# Altium schematic sheet nRF53.SchDoc: nRF5340
size B; DrawnBy: Sindre Hovland; Organization: Advanced Wearables Nordic Semi; Revision: V1; SheetNumber: 1; SheetTotal: 4
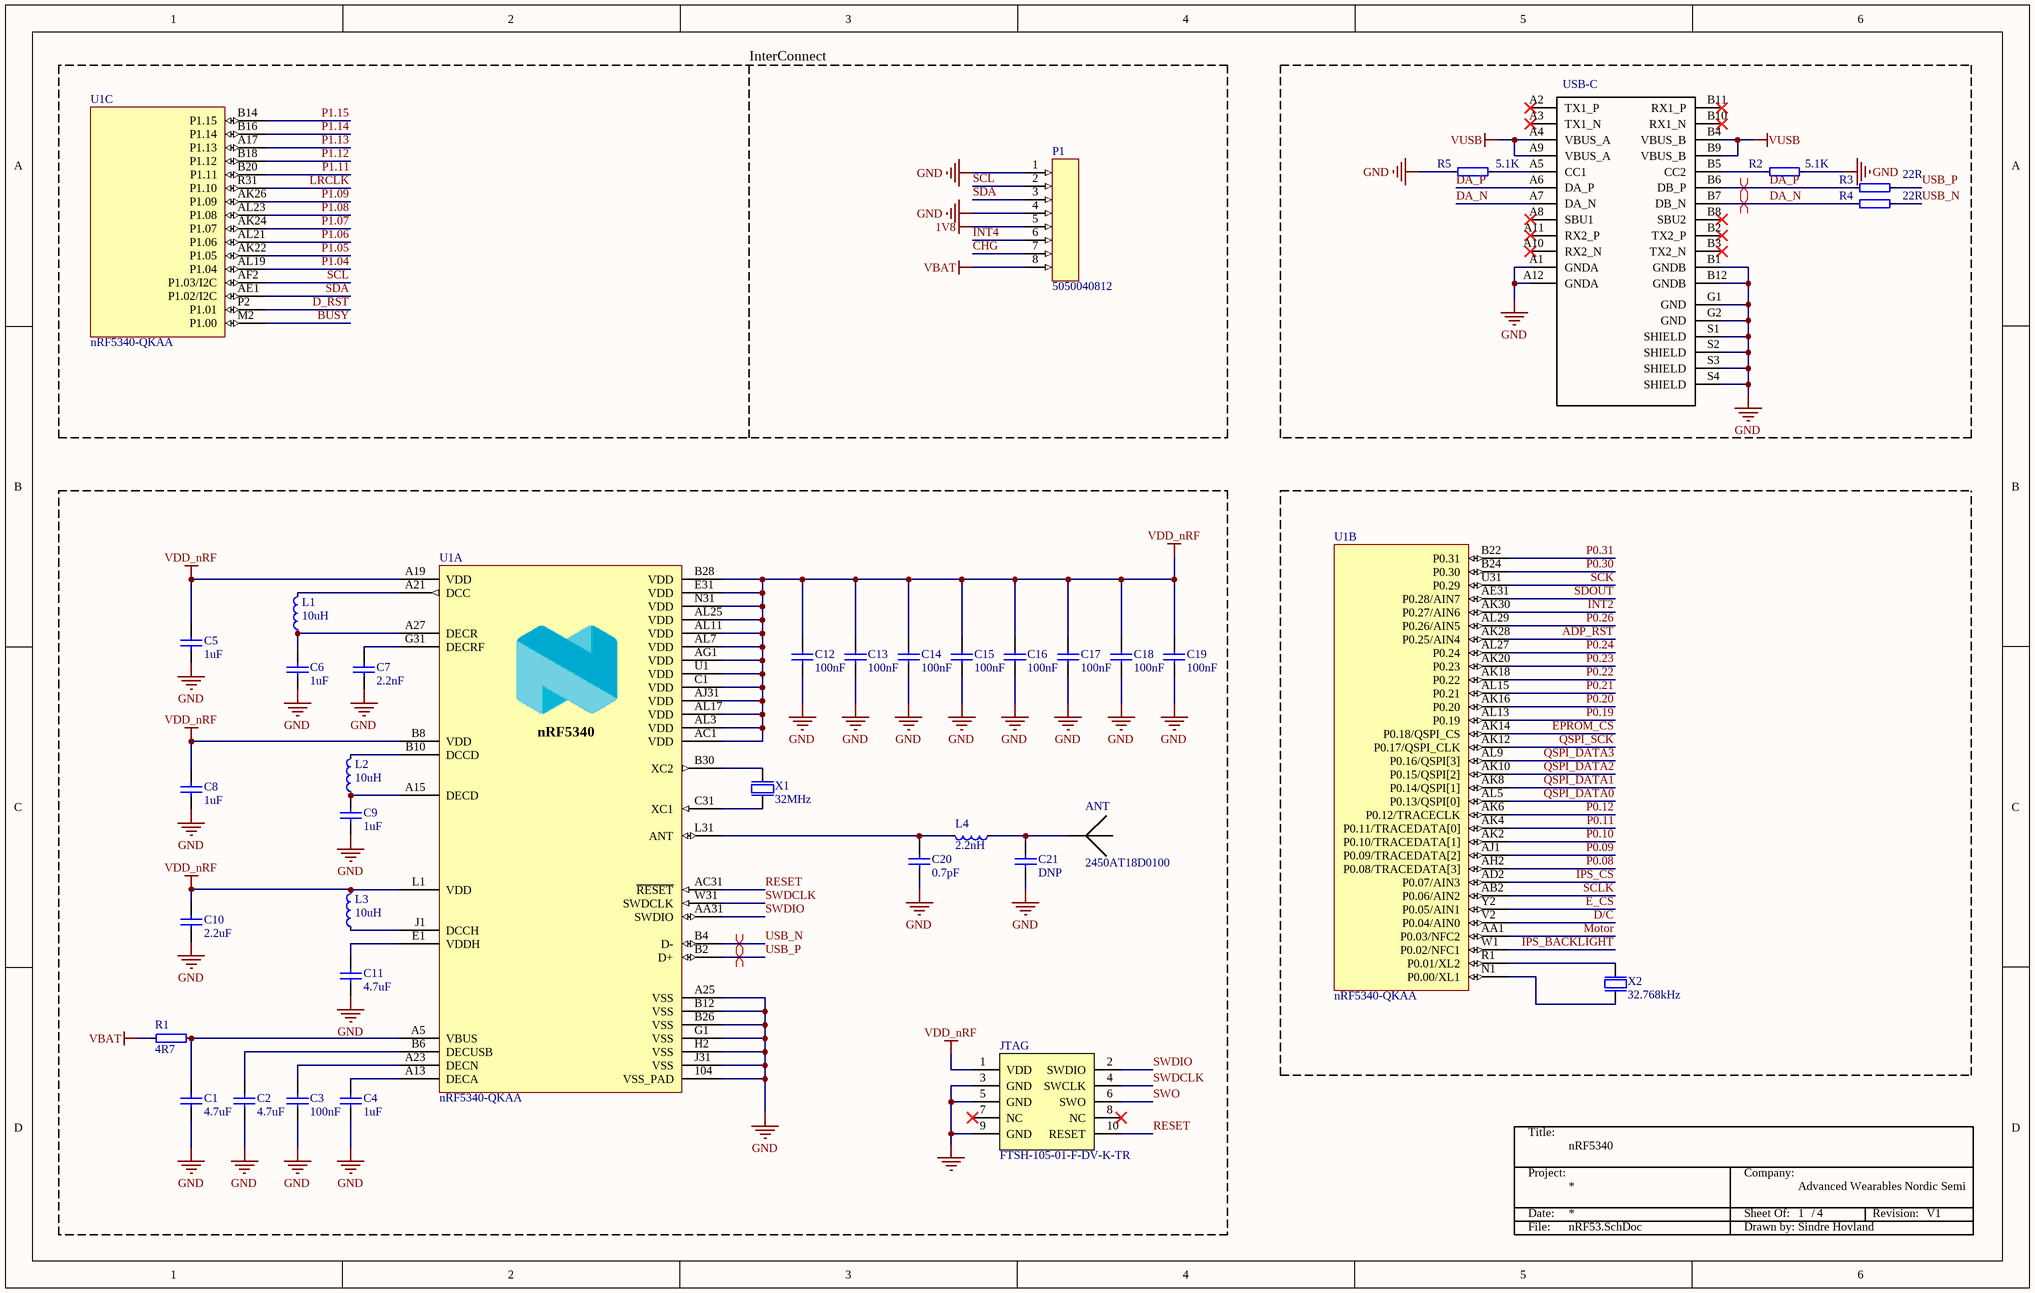
[diagram p0: nRF53.SchDoc]

## Parts
*  TitleBlock  (value not drawn)  (graphical)
ANT  2450AT18D0100  [2450AT18D0100_STD-L - Thin space]
C1  4.7uF  [C0402]
C2  4.7uF  [C0402]
C3  100nF  [C0402]
C4  1uF  [C0402]
C5  1uF  [C0402]
C6  1uF  [C0402]
C7  2.2nF  [C0402]
C8  1uF  [C0402]
C9  1uF  [C0402]
C10  2.2uF  [C0402]
C11  4.7uF  [C0402]
C12  100nF  [C0402]
C13  100nF  [C0402]
C14  100nF  [C0402]
C15  100nF  [C0402]
C16  100nF  [C0402]
C17  100nF  [C0402]
C18  100nF  [C0402]
C19  100nF  [C0402]
C20  0.7pF  [C0402]
C21  DNP  [C0402]
JTAG  FTSH-105-01-F-DV-K-TR  [TC2050-IDC-NLFP]
L1  10uH  [IND0402]
L2  10uH  [IND0402]
L3  10uH  [IND0402]
L4  2.2nH  [IND0402]
P1  5050040812  [5050040812]
R1  4R7  [RES0402]
R2  5.1K  [RES0402]
R3  22R  [RES0402]
R4  22R  [RES0402]
R5  5.1K  [RES0402]
U1  nRF5340-QKAA  [nRF5340]  (parts A,B,C of 3)
USB-C  2305018-2  [TE_2305018-2_2305018-2(Primary)]  (value not drawn)
X1  32MHz  [XTAL_2016]
X2  32.768kHz  [XTAL_2012]

## Blocks framed on the sheet
InterConnect: P1 U1

## Nets
1V8: P1.5
GND: ANT.2(GND) C1.1 C2.1 C3.1 C4.1 C5.1 C6.1 C7.1 C8.1 C9.1 C10.1 C11.1 C12.1 C13.1 C14.1 C15.1 C16.1 C17.1 C18.1 C19.1 C20.1 C21.1 JTAG.3(GND) JTAG.5(GND) JTAG.9(GND) P1.1 P1.4 R2.2 R5.1 U1.104(VSS_PAD) U1.A25(VSS) U1.B12(VSS) U1.B26(VSS) U1.G1(VSS) U1.H2(VSS) U1.J31(VSS) USB-C.A1(GNDA) USB-C.A12(GNDA) USB-C.B1(GNDB) USB-C.B12(GNDB) USB-C.G1(GND) USB-C.G2(GND) USB-C.S1(SHIELD) USB-C.S2(SHIELD) USB-C.S3(SHIELD) USB-C.S4(SHIELD) X1.2(GND) X1.4(GND)
VBAT: P1.8 R1.2
VDD_nRF: C5.2 C8.2 C10.2 C12.2 C13.2 C14.2 C15.2 C16.2 C17.2 C18.2 C19.2 JTAG.1(VDD) L3.2 U1.A19(VDD) U1.AC1(VDD) U1.AG1(VDD) U1.AJ31(VDD) U1.AL3(VDD) U1.AL7(VDD) U1.AL11(VDD) U1.AL17(VDD) U1.AL25(VDD) U1.B8(VDD) U1.B28(VDD) U1.C1(VDD) U1.E31(VDD) U1.L1(VDD) U1.N31(VDD) U1.U1(VDD)
VUSB: USB-C.A4(VBUS_A) USB-C.A9(VBUS_A) USB-C.B4(VBUS_B) USB-C.B9(VBUS_B)
ADP_RST: U1.AK28(P0.25/AIN4)
BUSY: U1.M2(P1.00)
CHG: P1.7
D/C: U1.V2(P0.04/AIN0)
D_RST: U1.P2(P1.01)
DA_N: R4.1 USB-C.A7(DA_N) USB-C.B7(DB_N)
DA_P: R3.1 USB-C.A6(DA_P) USB-C.B6(DB_P)
E_CS: U1.Y2(P0.05/AIN1)
EPROM_CS: U1.AK14(P0.18/QSPI_CS)
INT2: U1.AK30(P0.27/AIN6)
INT4: P1.6
IPS_BACKLIGHT: U1.W1(P0.02/NFC1)
IPS_CS: U1.AD2(P0.07/AIN3)
LRCLK: U1.R31(P1.10)
Motor: U1.AA1(P0.03/NFC2)
P0.08: U1.AH2(P0.08/TRACEDATA[3])
P0.09: U1.AJ1(P0.09/TRACEDATA[2])
P0.10: U1.AK2(P0.10/TRACEDATA[1])
P0.11: U1.AK4(P0.11/TRACEDATA[0])
P0.12: U1.AK6(P0.12/TRACECLK)
P0.19: U1.AL13(P0.19)
P0.20: U1.AK16(P0.20)
P0.21: U1.AL15(P0.21)
P0.22: U1.AK18(P0.22)
P0.23: U1.AK20(P0.23)
P0.24: U1.AL27(P0.24)
P0.26: U1.AL29(P0.26/AIN5)
P0.30: U1.B24(P0.30)
P0.31: U1.B22(P0.31)
P1.04: U1.AL19(P1.04)
P1.05: U1.AK22(P1.05)
P1.06: U1.AL21(P1.06)
P1.07: U1.AK24(P1.07)
P1.08: U1.AL23(P1.08)
P1.09: U1.AK26(P1.09)
P1.11: U1.B20(P1.11)
P1.12: U1.B18(P1.12)
P1.13: U1.A17(P1.13)
P1.14: U1.B16(P1.14)
P1.15: U1.B14(P1.15)
QSPI_DATA0: U1.AL5(P0.13/QSPI[0])
QSPI_DATA1: U1.AK8(P0.14/QSPI[1])
QSPI_DATA2: U1.AK10(P0.15/QSPI[2])
QSPI_DATA3: U1.AL9(P0.16/QSPI[3])
QSPI_SCK: U1.AK12(P0.17/QSPI_CLK)
RESET: JTAG.10(RESET) U1.AC31(~{RESET})
SCK: U1.U31(P0.29)
SCL: P1.2 U1.AF2(P1.03/I2C)
SCLK: U1.AB2(P0.06/AIN2)
SDA: P1.3 U1.AE1(P1.02/I2C)
SDOUT: U1.AE31(P0.28/AIN7)
SWDCLK: JTAG.4(SWCLK) U1.W31(SWDCLK)
SWDIO: JTAG.2(SWDIO) U1.AA31(SWDIO)
SWO: JTAG.6(SWO)
USB_N: R4.2 U1.B4(D-)
USB_P: R3.2 U1.B2(D+)
NetANT_1: ANT.1 C21.2 L4.1
NetC1_2: C1.2 R1.1 U1.A5(VBUS)
NetC2_2: C2.2 U1.B6(DECUSB)
NetC3_2: C3.2 U1.A23(DECN)
NetC4_2: C4.2 U1.A13(DECA)
NetC6_2: C6.2 L1.1 U1.A27(DECR)
NetC7_2: C7.2 U1.G31(DECRF)
NetC9_2: C9.2 L2.1 U1.A15(DECD)
NetC11_2: C11.2 U1.E1(VDDH)
NetC20_2: C20.2 L4.2 U1.L31(ANT)
NetL1_2: L1.2 U1.A21(DCC)
NetL2_2: L2.2 U1.B10(DCCD)
NetL3_1: L3.1 U1.J1(DCCH)
NetR2_1: R2.1 USB-C.B5(CC2)
NetR5_2: R5.2 USB-C.A5(CC1)
NetU1_B30: U1.B30(XC2) X1.3(out)
NetU1_C31: U1.C31(XC1) X1.1(inp)
NetU1_N1: U1.N1(P0.00/XL1) X2.2(out)
NetU1_R1: U1.R1(P0.01/XL2) X2.1(inp)

Not connected (* = marked no-connect by the designer): JTAG 7(NC)* 8(NC)*; U1 AG31(N.C.) D2(N.C.) F2(N.C.) T2(N.C.); USB-C A2(TX1_P)* A3(TX1_N)* A8(SBU1)* A10(RX2_N)* A11(RX2_P)* B2(TX2_P)* B3(TX2_N)* B8(SBU2)* B10(RX1_N)* B11(RX1_P)*

## Layout directives
differential pair: DA_N, DA_P, USB_N, USB_P

## Notes on the sheet
- (in symbol nRF5340-QKAAAA, part A) nRF5340
- (in symbol TitleBlock) Title:; Project:; Company:; Date:; Sheet Of:; /; Revision:; File:; Drawn by:

## Library data of the parts
ANT = Antenna with GND: 2.45 GHz chip antenna; Part Number: Johanson 2450AT18D0100_STD-L; Manufacturer: Johanson Technology; Part number IPS: N.A.; Artikkelnr Noca: 53059035; Manufacturer Part Number: 2450AT18D0100; ComponentLink1URL: *; ComponentLink1Description: Datasheet; ComponentLink2URL: *; ComponentLink2Description: Supplier link; HelpURL: http://www.johansontechnology.com/datasheets/antennas/2450AT18D0100.pdf; Footprint Doc: 2450AT18D0100; LatestRevisionDate: 2016-06-02; Pin Count: 4; Publisher: Nordic Semiconductor; Published: 2016-01-12; Value: 2450AT18D0100; Note: *; Supplier 1: Digi-Key; Supplier Part Number 1: 2450AT18D0100E; Supplier 2: Mouser; Supplier Part Number 2: 609-2450AT18D0100E
C1-C21 = CAP: Capacitor; Value: 100pF; Published: 8-Jun-2000; Revision: July-2002: Re-released for DXP Platform.; Publisher: Altium Limited
JTAG = JTAG: Pin Header 2x5, 1.27mm (50mil), SMD, Keying Shroud; Part Number: Pin Header 2x5 SMD, 1.27mm, KS; Manufacturer: W-CON; Manufacturer Part Number: 3132-10MS0BK00R1; Part number IPS: N.A.; Artikkelnr Noca: 55010009; Footprint Doc: HDR_2x5-SMD-1.27mm; LatestRevisionDate: 2016-04-21; Pin Count: 10; Publisher: Nordic Semiconductor; Published: 2016-01-22; Value: Pin Header 2x5, 1.27mm; Note: *; ComponentLink1URL: *; ComponentLink1Description: Datasheet; ComponentLink2URL: *; ComponentLink2Description: Supplier link; HelpURL: \\hizz\pro\app9717\Datasheet\connectores\W-CON\3132-XXMXXBK00XX.pdf; Supplier 1: Cabcon; Supplier Part Number 1: 3132-10MS0BK00R1; Supplier 2: Samtec; Supplier Part Number 2: FTSH-105-01-F-DV-K
L1-L4 = IND: Inductor; Part Number: FB0402-120R@100M-500mA; Manufacturer: Murata; Manufacturer Part Number: BLM15AG121SN1D; Part number IPS: N.A.; Value: 120R/0.55A; Note: Chip EMIFIL Inductor Type Chip Ferrite Bead; Artikkelnr Noca: 33029317; Footprint Doc: 0402; LatestRevisionDate: 2014-01-10; Pin Count: 2; Publisher: Nordic Semiconductor; Published: 2011-11-14; ComponentLink1URL: *; ComponentLink1Description: Datasheet; ComponentLink2URL: *; ComponentLink2Description: Supplier link; HelpURL: http://search.murata.co.jp/Ceramy/image/img/PDF/ENG/L0110S0100BLM15A_SN.pdf
P1 = 8 Pin Connector: Generic 8 pin connector, see footprint for MPN
R1-R5 = RES: Resistor, ±5%, 0.05W; Part Number: R0201-0R; Part number IPS: 00000003245; Value: 0R; Note: Chip Res 5%; Artikkelnr Noca: N.A.; Manufacturer: *; Manufacturer Part Number: *; ComponentLink1URL: *; ComponentLink1Description: Datasheet; ComponentLink2URL: *; ComponentLink2Description: Supplier link; HelpURL: *; Footprint Doc: 0201; LatestRevisionDate: 2017-11-09; Pin Count: 2; Publisher: Nordic Semiconductor; Published: 2014-11-13; Supplier 1: *; Supplier Part Number 1: *; Supplier 2: *; Supplier Part Number 2: *
U1 = nRF5340-QKAAAA: Multi-protocol Bluetooth Low Energy, IEEE 802.15.4, ANT and 2.4GHz proprietary system-on-chip; Part Number: nRF5340-QKAADA; Manufacturer: Nordic Semiconductor; Artikkelnr Noca: N.A.; Footprint Doc: AQFN-98; LatestRevisionDate: 2019-03-28; Pin Count: 98; Published: 2017-01-09; Value: nRF5340-QKAA; Manufacturer Part Number: *; ComponentLink1URL: *; ComponentLink1Description: Datasheet; ComponentLink2URL: *; ComponentLink2Description: Supplier link; HelpURL: *; Publisher: Nordic Semiconductor; Note: *; Supplier 1: Nordic Semiconductor; Supplier Part Number 1: nRF5340-QKAADA; Supplier 2: *; Supplier Part Number 2: *; Part number IPS: N.A.
USB-C = IPX8 USBC: TYPE C Right Angle Sealable SMT IPX8 3.1 GEN 2 Wire to Board USB; MF: TE Connectivity; TE_purchase_URL: https://www.te.com/usa-en/product-2305018-2.html?te_bu=Cor&te_type=disp&te_campaign=seda_glo_cor-seda-global-disp-prtnr-fy19-seda-model-bom-cta_sma-317_1&elqCampaignId=32493; SnapEDA_Link: https://www.snapeda.com/parts/2305018-2/TE%20Connectivity%20AMP%20Connectors/view-part/?ref=snap; Availability: Unavailable; Package: None; Price: None; MP: 2305018-2; Value: *
X1 = XTAL_SMD2016: XTAL SMD 2016, 32MHz, Cl=8pF, Total Tol: ±40ppm; Part Number: XTAL_SMD2016_32MHz_8pF_General; LatestRevisionDate: 2016-08-19; Pin Count: 4; Publisher: Nordic Semiconductor; Published: 2016-08-19; Value: 32MHz; Footprint Doc: XTAL_2016; Manufacturer: *; Manufacturer Part Number: *
X2 = XTAL_2-pin: XTAL SMD 32.768kHz, 9pF, ±20ppm; Part Number: XTAL_SMD3215_32.768kHz_9pF_NDK; Manufacturer: NDK; Manufacturer Part Number: NX3215SA-32.768K-STD-MUA-9; Part number IPS: N.A.; Artikkelnr Noca: 22010049; LatestRevisionDate: 2017-10-23; Pin Count: 2; Publisher: Nordic Semiconductor; Published: 2017-10-23; Value: 32.768kHz; Note: XTAL SMD 32.768kHz; Footprint Doc: XTAL_3215; ComponentLink1URL: *; ComponentLink1Description: Datasheet; ComponentLink2URL: *; ComponentLink2Description: Supplier link; HelpURL: *; Supplier 1: Digi-Key; Supplier Part Number 1: 535-11937-6-ND